# EAGLE design ECsimple (EAGLE 7.5.0)
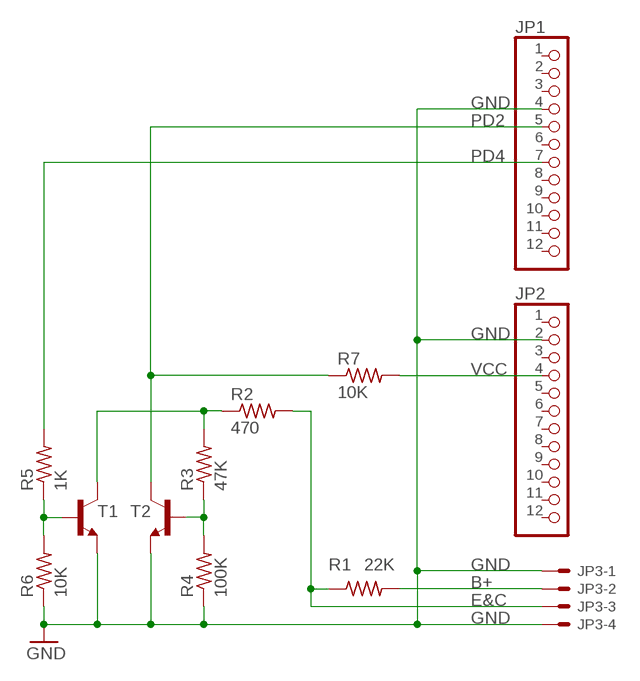
[diagram p0: schematic, sheet 1]

## Parts
JP1  PINHD-1X12-CB  [1X12-CB]
JP2  PINHD-1X12-CB  [1X12-CB]
JP3  HDR_PLAIN_1X4  [HDR_1X4]
R1  22K  R-US_0204/7  [0204/7]
R2  470  R-US_0204/7  [0204/7]
R3  47K  R-US_0204/7  [0204/7]
R4  100K  R-US_0204/7  [0204/7]
R5  1K  R-US_0204/7  [0204/7]
R6  10K  R-US_0204/7  [0204/7]
R7  10K  R-US_0204/7  [0204/7]
T1  NPN-TRANSISTORCLEAN  [TO92-NONPOLARIZED-CLEAN]
T2  NPN-TRANSISTORCLEAN  [TO92-NONPOLARIZED-CLEAN]

## Nets
B+: JP3.2 R1.2
E&C: JP3.3 R1.1 R2.2
GND: JP1.4 JP2.2 JP3.1 JP3.4 R4.1 R6.1 T1.E T2.E
N$21: R2.1 R3.2 T1.C
N$42: R3.1 R4.2 T2.B
N$48: R5.1 R6.2 T1.B
PD2: JP1.5 R7.1 T2.C
PD4: JP1.7 R5.2
VCC: JP2.4 R7.2
Unconnected: JP1.1 JP1.2 JP1.3 JP1.6 JP1.8 JP1.9 JP1.10 JP1.11 JP1.12 JP2.1 JP2.3 JP2.5 JP2.6 JP2.7 JP2.8 JP2.9 JP2.10 JP2.11 JP2.12

## Library data of the parts
JP1 JP2 = adafruit:PINHD-1X12: PIN HEADER
JP3 = stuart:HDR_PLAIN_1X4: 1x4 header, plain
R1-R7 = adafruit:R-US_: RESISTOR, American symbol
T1 T2 = stuart:NPN-TRANSISTOR: NPN TRANSISTOR

## Board
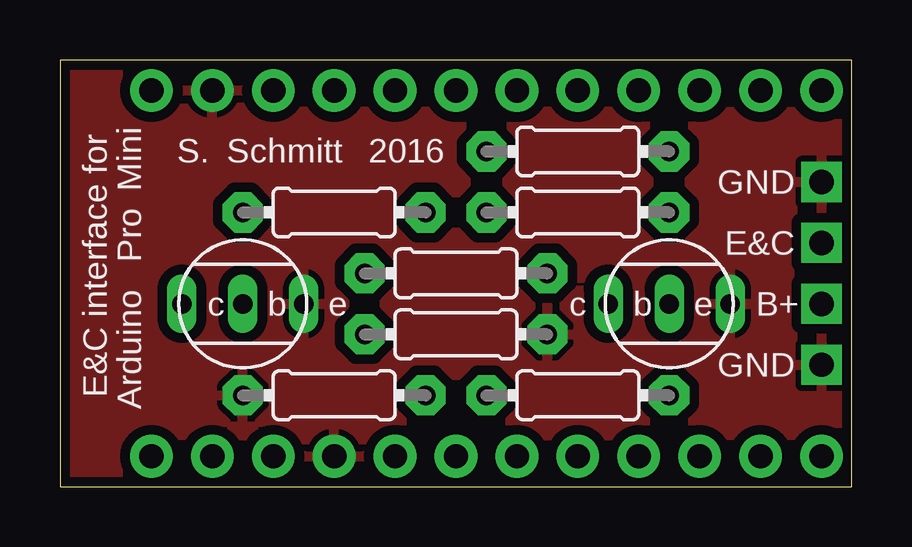
[diagram p1: board, top side]
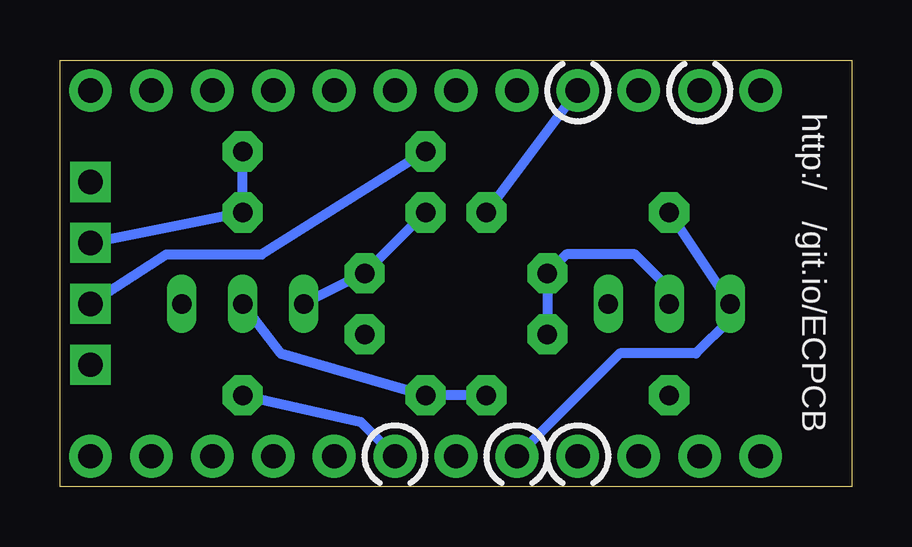
[diagram p2: board, bottom side, seen from below]

Size 33.02 x 17.78 mm. Coordinates in mm from the lower left corner, seen from the top.
Outline: 0,17.78 0,0 33.02,0 33.02,17.78 0,17.78
Copper layers (1*16): Top 0.0356mm / dielectric 1.5011mm / Bottom 0.0356mm
Design rules "LaenPCBOrder *": minimum track width 6mil, minimum drill 13mil, track to track 6mil, track to pad 6mil, pad to pad 6mil, via to via 6mil, smd to smd 6mil, copper to edge 15mil, drill to drill 6mil, minimum pad ring 7mil, minimum via ring 7mil, stop-mask expansion 3mil, vias tented up to drill 20mil, thermal gap 10mil

### Footprints (pad centres in the part's own frame; a part is rotated, then mirrored left to right if it is on the bottom)
1X12-CB = drill 1.016 pad 1.778: 1 -13.97,0; 2 -11.43,0; 3 -8.89,0; 4 -6.35,0; 5 -3.81,0; 6 -1.27,0; 7 1.27,0; 8 3.81,0; 9 6.35,0; 10 8.89,0; 11 11.43,0; 12 13.97,0
HDR_1X4 = drill 1.016 pad 1.676 square: 1 -3.81,0; 2 -1.27,0; 3 1.27,0; 4 3.81,0
0204/7 = drill 0.813 pad 1.676 octagon: 1 -3.81,0; 2 3.81,0
TO92-NONPOLARIZED-CLEAN = drill 0.813 long: B 0,0; C 2.54,0; E -2.54,0

### Placement (x,y rotation side)
JP1  17.78,1.27 0 top
JP2  17.78,16.51 0 top
JP3  31.75,8.89 90 top
R1  21.59,13.97 180 top
R2  21.59,11.43 0 top
R3  16.51,8.89 0 top
R4  16.51,6.35 180 top
R5  21.59,3.81 0 top
R6  11.43,3.81 0 top
R7  11.43,11.43 0 top
T1  25.4,7.62 180 top
T2  7.62,7.62 180 top

### Tracks (layer width: path | path; a pad name or v marks a point on that pad's centre or on a via)
B+
  Bottom 0.406: R1.2 24.61,9.68 28.57,9.68 JP3.2
E&C
  Bottom 0.406: R1.1 R2.2 JP3.3
GND
  pour Top (isolate 0.406): 0,0 0,17.78 33.02,17.78 33.02,0
N$21
  Bottom 0.406: R2.1 R3.2 T1.C
N$42
  Bottom 0.406: R4.2 R3.1 11.91,9.68 9.05,9.68 7.62,8.26 T2.B
N$48
  Bottom 0.406: T1.B 23.81,5.56 R5.1 R6.2
PD2
  Bottom 0.406: R7.1 T2.C 5.08,6.99 6.51,5.56 9.68,5.56 JP1.5
PD4
  Bottom 0.406: JP1.7 20.48,2.7 R5.2
VCC
  Bottom 0.406: R7.2 JP2.4

### Text on the board
tPlace: Mini | S. | Schmitt | 2016 | GND | Pro | E&C | E&C interface for | c | b | e | c | b | e | B+ | Arduino | GND
bPlace: http:/ | /git.io/ECPCB